# Altium schematic sheet PMIC_GTXs.SchDoc: GTX Power Supplies
size B; CheckedBy: Jason Sullins; Author: Jordan Harris-Toovy; Revision: 0.2; SheetNumber: 14; SheetTotal: 22; Size: ANSI B
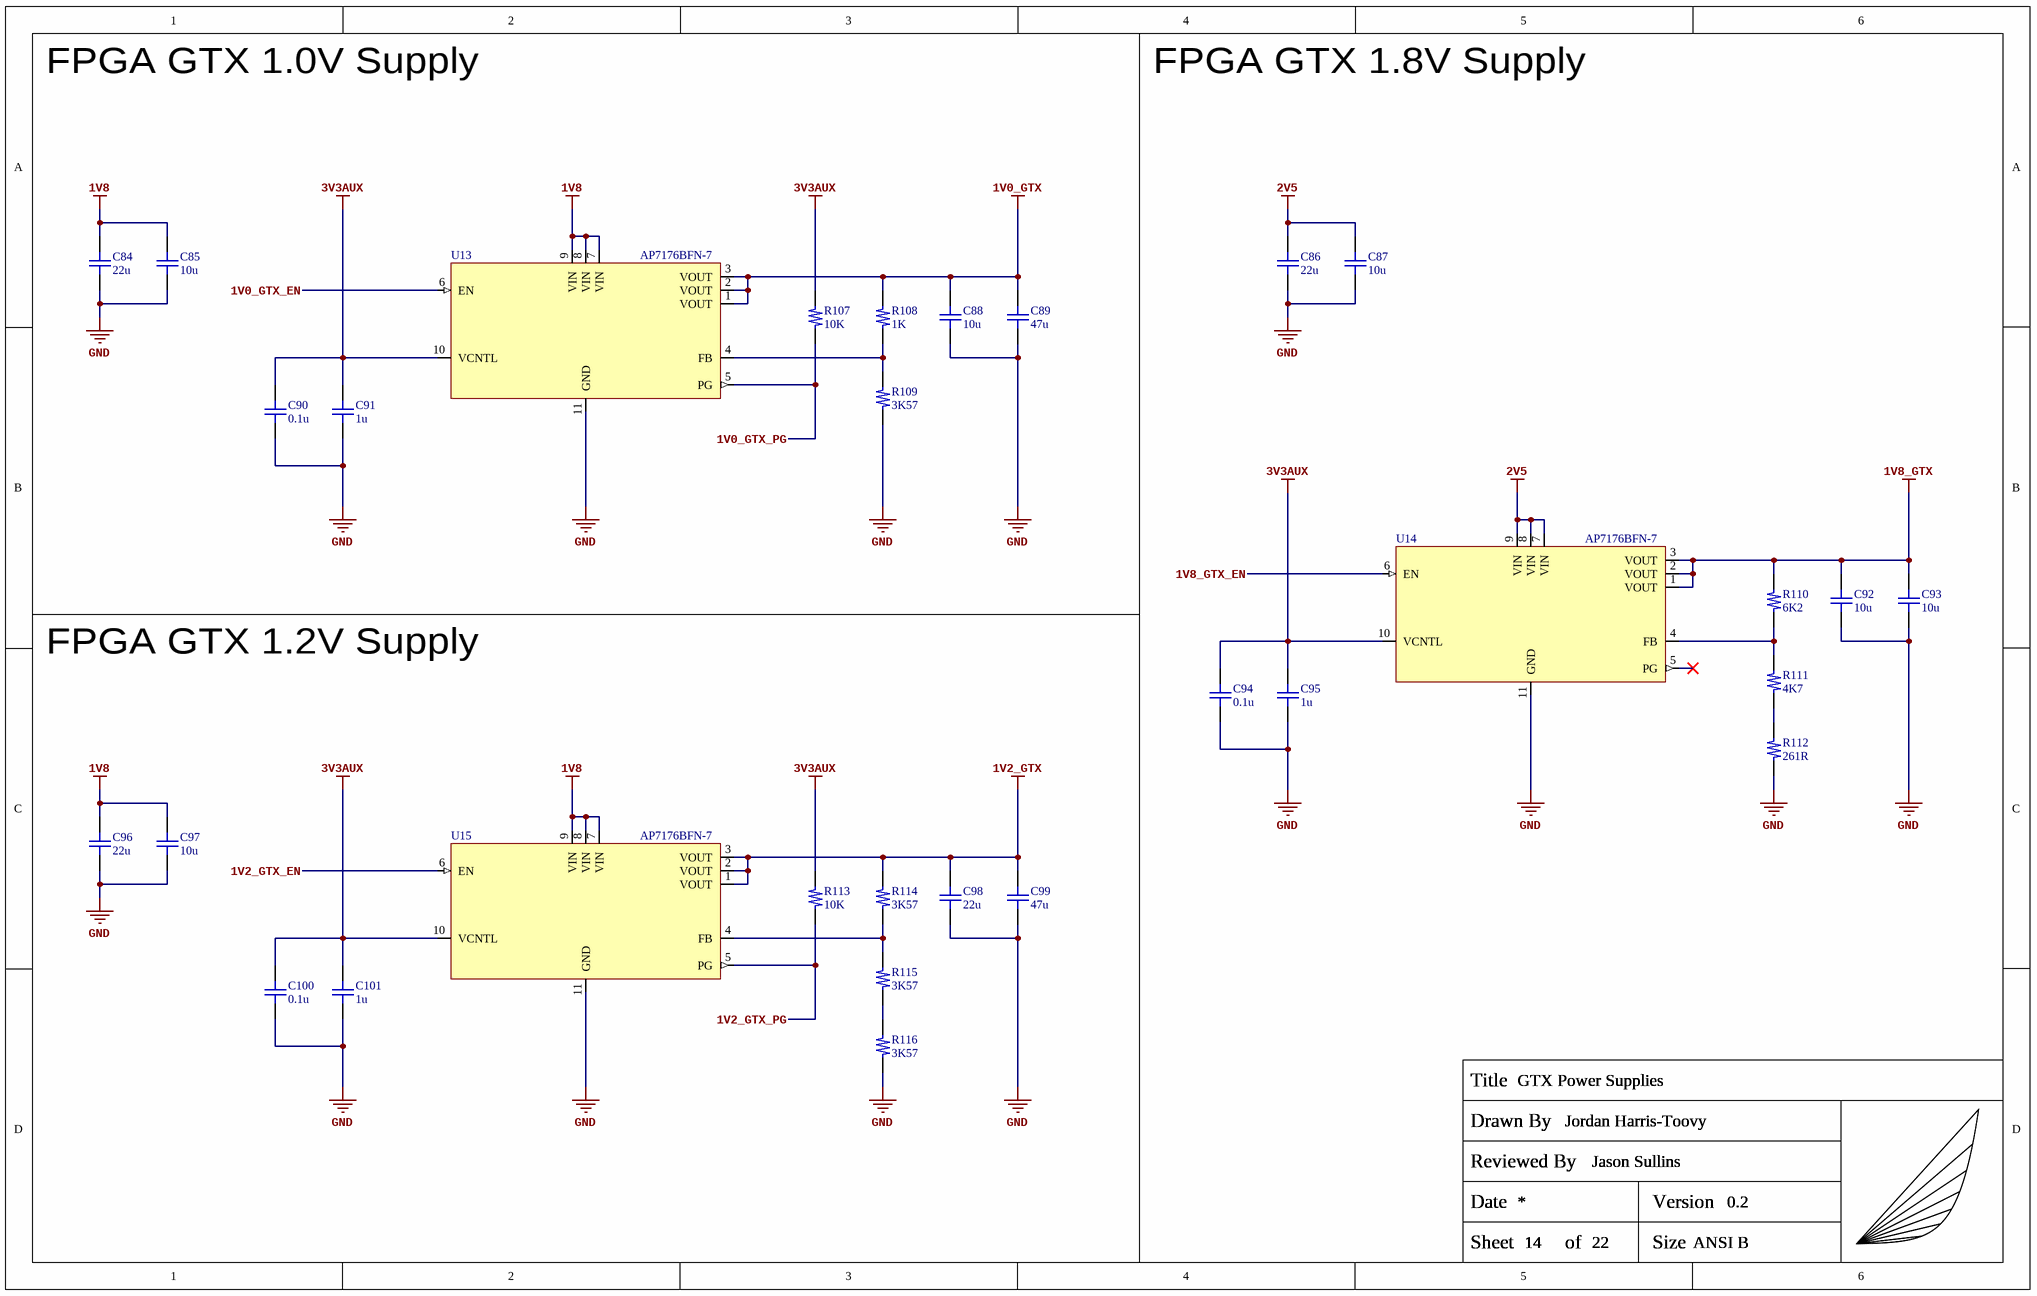
[diagram p0: PMIC_GTXs.SchDoc]

## Parts
C84  22u  [C_0603_Generic]
C85  10u  [C_0402_Generic]
C86  22u  [C_0603_Generic]
C87  10u  [C_0402_Generic]
C88  10u  [C_0402_Generic]
C89  47u  [C_0603_Generic]
C90  0.1u  [C_0402_Generic]
C91  1u  [C_0402_Generic]
C92  10u  [C_0402_Generic]
C93  10u  [C_0402_Generic]
C94  0.1u  [C_0402_Generic]
C95  1u  [C_0402_Generic]
C96  22u  [C_0603_Generic]
C97  10u  [C_0402_Generic]
C98  22u  [C_0603_Generic]
C99  47u  [C_0603_Generic]
C100  0.1u  [C_0402_Generic]
C101  1u  [C_0402_Generic]
R107  10K  [R_0402_Generic]
R108  1K  [R_0402_Generic]
R109  3K57  [R_0402_Generic]
R110  6K2  [R_0402_Generic]
R111  4K7  [R_0402_Generic]
R112  261R  [R_0402_Generic]
R113  10K  [R_0402_Generic]
R114  3K57  [R_0402_Generic]
R115  3K57  [R_0402_Generic]
R116  3K57  [R_0402_Generic]
TITLEBLOCK?  Capstone_Title_Block  (value not drawn)  (graphical)
U13  AP7176BFN-7  [DIODES_INC_U-DFN3030-10]
U14  AP7176BFN-7  [DIODES_INC_U-DFN3030-10]
U15  AP7176BFN-7  [DIODES_INC_U-DFN3030-10]

## Nets
1V0_GTX: C88.2 C89.2 R108.2 U13.1(VOUT) U13.2(VOUT) U13.3(VOUT)
1V2_GTX: C98.2 C99.2 R114.2 U15.1(VOUT) U15.2(VOUT) U15.3(VOUT)
1V8: C84.2 C85.2 C96.2 C97.2 U13.7(VIN) U13.8(VIN) U13.9(VIN) U15.7(VIN) U15.8(VIN) U15.9(VIN)
1V8_GTX: C92.2 C93.2 R110.2 U14.1(VOUT) U14.2(VOUT) U14.3(VOUT)
2V5: C86.2 C87.2 U14.7(VIN) U14.8(VIN) U14.9(VIN)
3V3AUX: C90.2 C91.2 C94.2 C95.2 C100.2 C101.2 R107.2 R113.2 U13.10(VCNTL) U14.10(VCNTL) U15.10(VCNTL)
GND: C84.1 C85.1 C86.1 C87.1 C88.1 C89.1 C90.1 C91.1 C92.1 C93.1 C94.1 C95.1 C96.1 C97.1 C98.1 C99.1 C100.1 C101.1 R109.1 R112.1 R116.1 U13.11(GND) U14.11(GND) U15.11(GND)
1V0_GTX_EN: U13.6(EN)
1V0_GTX_PG: R107.1 U13.5(PG)
1V2_GTX_EN: U15.6(EN)
1V2_GTX_PG: R113.1 U15.5(PG)
1V8_GTX_EN: U14.6(EN)
NetR108_1: R108.1 R109.2 U13.4(FB)
NetR110_1: R110.1 R111.2 U14.4(FB)
NetR111_1: R111.1 R112.2
NetR114_1: R114.1 R115.2 U15.4(FB)
NetR115_1: R115.1 R116.2

Not connected (* = marked no-connect by the designer): U14 5(PG)*

## Notes on the sheet
- FPGA GTX 1.0V Supply
- FPGA GTX 1.8V Supply
- FPGA GTX 1.2V Supply
- (in symbol Capstone_Title_Block) Title; Drawn By; Reviewed By; Date; Version; Sheet; of; Size

## Library data of the parts
C84 C86 C96 C98 = GRM188R60J226MEA0D: 22µF 6.3V X5R SMD ceramic capacitor in 0603 size; Manufacturer: Murata Electronics; Manufacturer Part Number: GRM188R60J226MEA0D
C85 C87 C88 C92 C93 C97 = CC0402MRX5R6BB106: 10µF 10V X5R SMD ceramic capacitor in 0402 size; Manufacturer: YAGEO; Manufacturer Part Number: CC0402MRX5R6BB106
C89 C99 = GRM188R60J476ME15D: 47µF 6.3V X5R SMD ceramic capacitor in 0603 size; Manufacturer: Murata Electronics; Manufacturer Part Number: GRM188R60J476ME15D
C90 C94 C100 = GRM155R71C104KA88D: 0.1µF 16V X7R SMD ceramic capacitor in 0402 size; Manufacturer: Murata Electronics; Manufacturer Part Number: GRM155R71C104KA88D
C91 C95 C101 = GRM155Z71A105KE01D: 1µF 10V X7R SMD ceramic capacitor in 0402 size; Manufacturer: Murata Electronics; Manufacturer Part Number: GRM155Z71A105KE01D
R107 R113 = ERJ-2RKF1002X: 10KOhm 1% 1/10W SMD resistor in 0402 size; Manufacturer: Panasonic; Manufacturer Part Number: ERJ-2RKF1002X
R108 = ERJ-2RKF1001X: 1KOhm 1% 1/10W SMD resistor in 0402 size; Manufacturer: Panasonic; Manufacturer Part Number: ERJ-2RKF1001X
R109 R114-R116 = ERJ-2RKF3571X: 3.57KOhm 1% 1/10W SMD resistor in 0402 size; Manufacturer: Panasonic; Manufacturer Part Number: ERJ-2RKF3571X
R110 = ERJ-2RKF6201X: 6.2KOhm 1% 1/10W SMD resistor in 0402 size; Manufacturer: Panasonic; Manufacturer Part Number: ERJ-2RKF6201X
R111 = ERJ-2RKF4701X: 4.7KOhm 1% 1/10W SMD resistor in 0402 size; Manufacturer: Panasonic; Manufacturer Part Number: ERJ-2RKF4701X
R112 = ERJ-2RKF2610X: 261Ohm 1% 1/10W SMD resistor in 0402 size; Manufacturer: Panasonic; Manufacturer Part Number: ERJ-2RKF2610X
TITLEBLOCK? = Capstone_Title_Block: Custom title block with personal logo; Manufacturer: NONE; Manufacturer Part Number: NONE
U13-U15 = AP7176BFN-7: LDO 0.8-3.12V 3A 10-UFDFN Diodes Incorporated; Manufacturer: Diodes Incorporated; Manufacturer Part Number: AP7176BFN-7